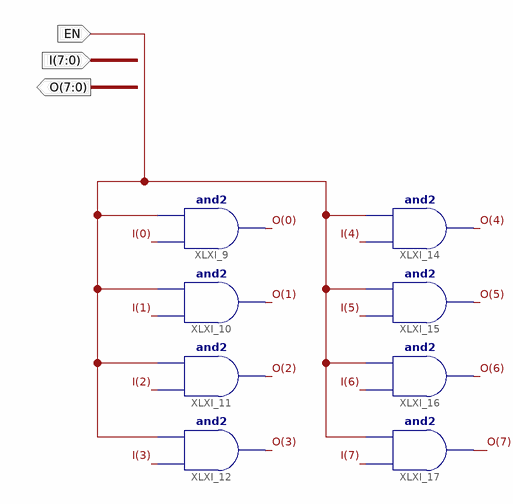
[diagram p0: schematic sheet 1]
// Xilinx ISE schematic BUFGCE_BUS8.sch (spartan6) as structural Verilog: 8 symbols, 3 ports
module BUFGCE_BUS8 (
  input  EN,
  input  [7:0] I,
  output [7:0] O
);

  and XLXI_9 (O[0], I[0], EN);
  and XLXI_10 (O[1], I[1], EN);
  and XLXI_11 (O[2], I[2], EN);
  and XLXI_12 (O[3], I[3], EN);
  and XLXI_14 (O[4], I[4], EN);
  and XLXI_15 (O[5], I[5], EN);
  and XLXI_16 (O[6], I[6], EN);
  and XLXI_17 (O[7], I[7], EN);
endmodule
